# EAGLE design ltar-minidisplay (EAGLE 6.5.0)
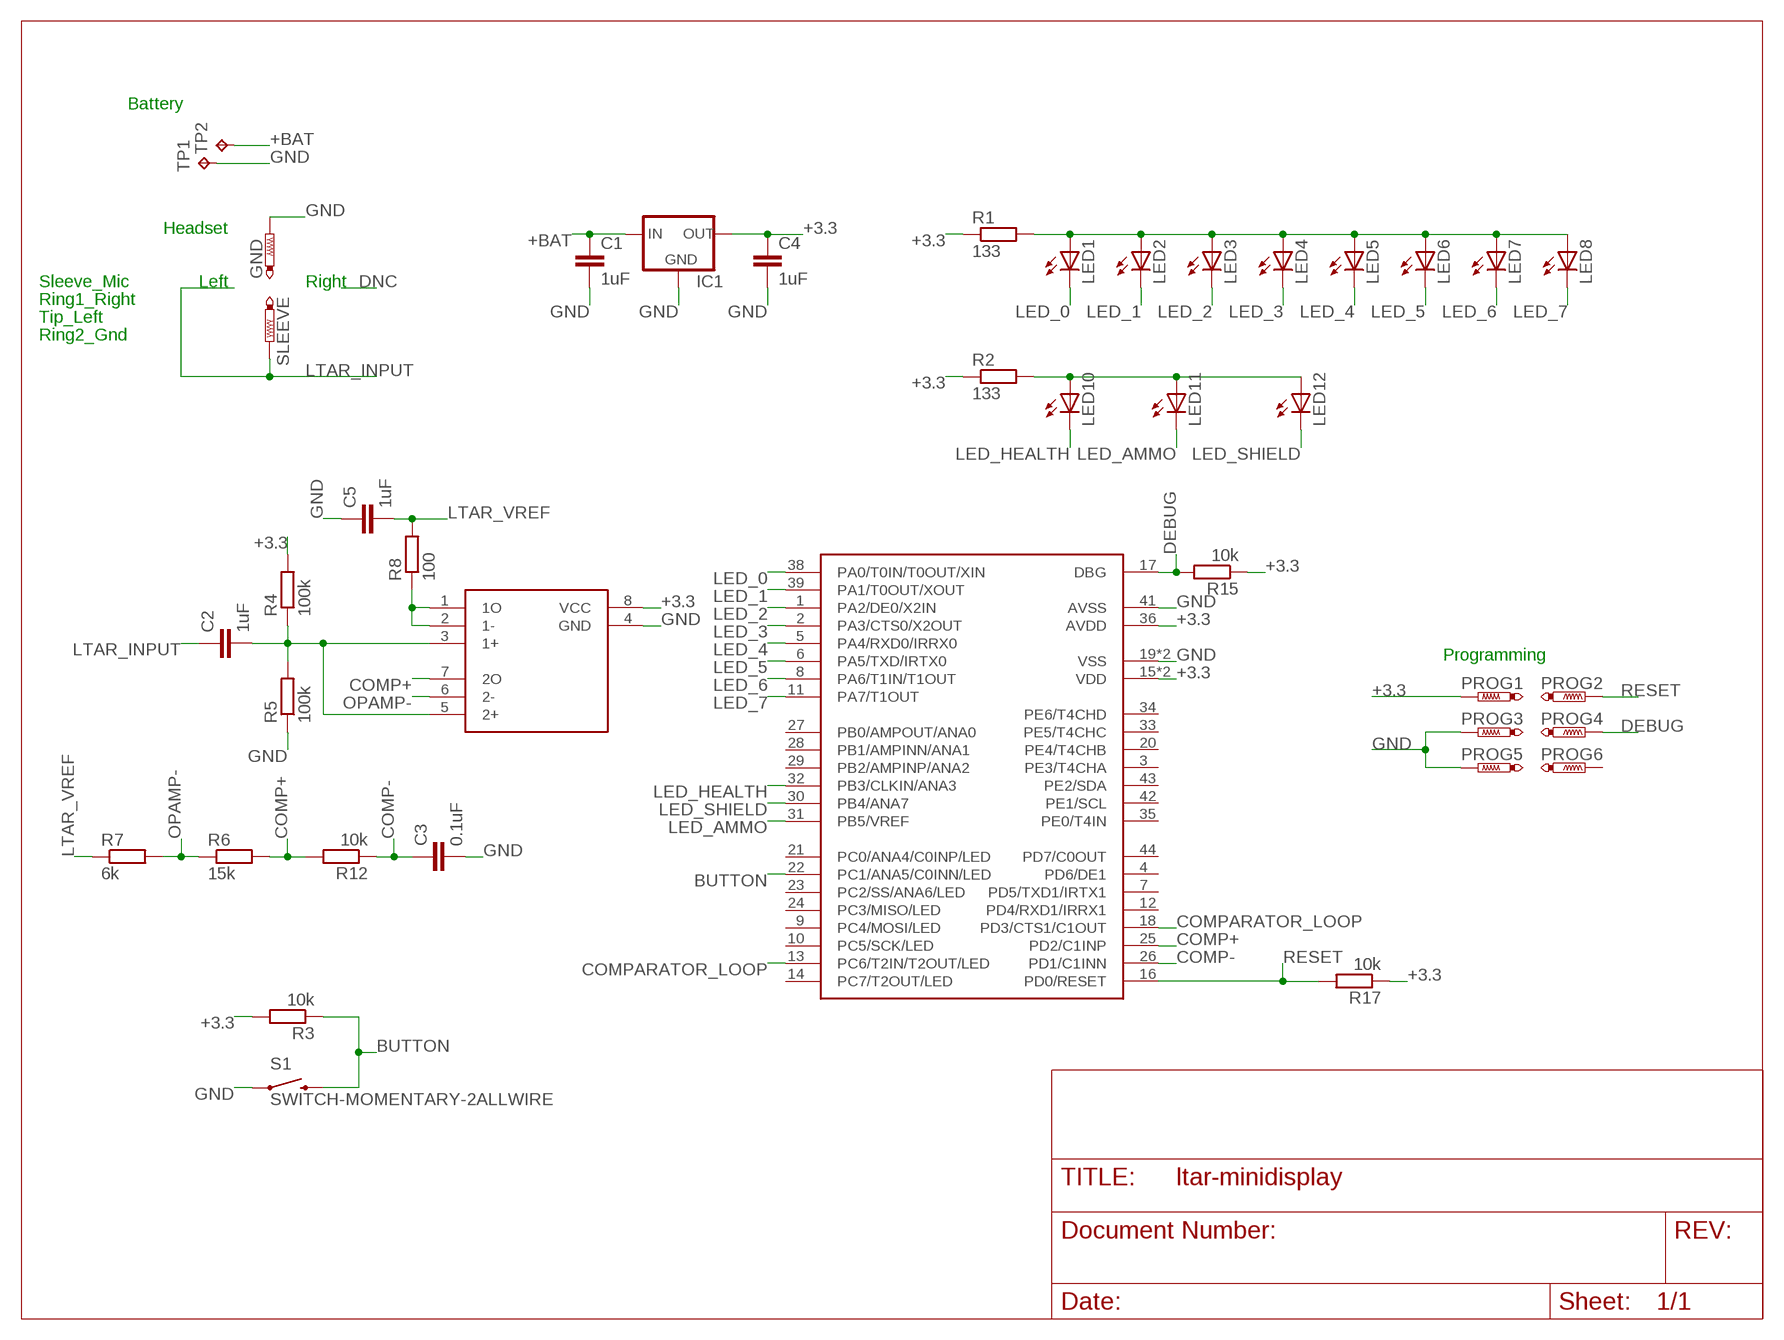
[diagram p0: schematic, sheet 1]

## Parts
C1  1uF  C-EUC0603  [C0603]
C2  1uF  C-EUC0603  [C0603]
C3  0.1uF  C-EUC0603  [C0603]
C4  1uF  C-EUC0603  [C0603]
C5  1uF  C-EUC0603  [C0603]
GND  PTR1TP11SQ  [TP11SQ]
IC1  XC63FPM  [SOT23]
LED1  LEDCHIPLED_0805  [CHIPLED_0805]
LED2  LEDCHIPLED_0805  [CHIPLED_0805]
LED3  LEDCHIPLED_0805  [CHIPLED_0805]
LED4  LEDCHIPLED_0805  [CHIPLED_0805]
LED5  LEDCHIPLED_0805  [CHIPLED_0805]
LED6  LEDCHIPLED_0805  [CHIPLED_0805]
LED7  LEDCHIPLED_0805  [CHIPLED_0805]
LED8  LEDCHIPLED_0805  [CHIPLED_0805]
LED10  LEDCHIPLED_0805  [CHIPLED_0805]
LED11  LEDCHIPLED_0805  [CHIPLED_0805]
LED12  LEDCHIPLED_0805  [CHIPLED_0805]
PROG1  PTR1TP15SQ  [TP15SQ]
PROG2  PTR1TP15SQ  [TP15SQ]
PROG3  PTR1TP15SQ  [TP15SQ]
PROG4  PTR1TP15SQ  [TP15SQ]
PROG5  PTR1TP15SQ  [TP15SQ]
PROG6  PTR1TP15SQ  [TP15SQ]
R1  133  R-EU_M0805  [M0805]
R2  133  R-EU_M0805  [M0805]
R3  10k  R-EU_M0805  [M0805]
R4  100k  R-EU_M0805  [M0805]
R5  100k  R-EU_M0805  [M0805]
R6  15k  R-EU_M0805  [M0805]
R7  6k  R-EU_M0805  [M0805]
R8  100  R-EU_M0805  [M0805]
R12  10k  R-EU_M0805  [M0805]
R15  10k  R-EU_M0805  [M0805]
R17  10k  R-EU_M0805  [M0805]
S1  SWITCH-MOMENTARY-2ALLWIRE  [TACTILE_SWITCH_SMD]
SLEEVE  PTR1TP11SQ  [TP11SQ]
TP1  TPB1,27  [B1,27]
TP2  TPB1,27  [B1,27]
U$1  Z8F2480-44  [QFP44]
U$2  TI_LM258  [SO08]

## Nets
+3.3: C4.1 IC1.2(OUT) PROG1.TP R1.1 R2.1 R3.2 R4.2 R15.1 R17.1 U$1.15(VDD) U$1.36(AVDD) U$1.37(VDD) U$2.8(VCC)
+BAT: C1.1 IC1.3(IN) TP2.TP
BUTTON: R3.1 S1.3 S1.4 U$1.22(PC1/ANA5/C0INN/LED)
COMP+: R6.2 R12.2 U$1.25(PD2/C1INP) U$2.7(2O)
COMP-: C3.1 R12.1 U$1.26(PD1/C1INN)
COMPARATOR_LOOP: U$1.13(PC6/T2IN/T2OUT/LED) U$1.18(PD3/CTS1/C1OUT)
DEBUG: PROG4.TP R15.2 U$1.17(DBG)
GND: C1.2 C3.2 C4.2 C5.1 GND.TP IC1.1(GND) PROG3.TP PROG5.TP R5.1 S1.1 S1.2 TP1.TP U$1.19(VSS) U$1.40(VSS) U$1.41(AVSS) U$2.4(GND)
LED_0: LED1.C U$1.38(PA0/T0IN/T0OUT/XIN)
LED_1: LED2.C U$1.39(PA1/T0OUT/XOUT)
LED_2: LED3.C U$1.1(PA2/DE0/X2IN)
LED_3: LED4.C U$1.2(PA3/CTS0/X2OUT)
LED_4: LED5.C U$1.5(PA4/RXD0/IRRX0)
LED_5: LED6.C U$1.6(PA5/TXD/IRTX0)
LED_6: LED7.C U$1.8(PA6/T1IN/T1OUT)
LED_7: LED8.C U$1.11(PA7/T1OUT)
LED_AMMO: LED11.C U$1.31(PB5/VREF)
LED_HEALTH: LED10.C U$1.32(PB3/CLKIN/ANA3)
LED_SHIELD: LED12.C U$1.30(PB4/ANA7)
LTAR_INPUT: C2.1 SLEEVE.TP
LTAR_VREF: C5.2 R7.1 R8.2
N$1: R8.1 U$2.1(1O) U$2.2(1-)
N$2: LED1.A LED2.A LED3.A LED4.A LED5.A LED6.A LED7.A LED8.A R1.2
N$3: LED10.A LED11.A LED12.A R2.2
OPAMP+: C2.2 R4.1 R5.2 U$2.3(1+) U$2.5(2+)
OPAMP-: R6.1 R7.2 U$2.6(2-)
RESET: PROG2.TP R17.2 U$1.16(PD0/RESET)
Unconnected: PROG6.TP U$1.3(PE3/T4CHA) U$1.4(PD6/DE1) U$1.7(PD5/TXD1/IRTX1) U$1.9(PC4/MOSI/LED) U$1.10(PC5/SCK/LED) U$1.12(PD4/RXD1/IRRX1) U$1.14(PC7/T2OUT/LED) U$1.20(PE4/T4CHB) U$1.21(PC0/ANA4/C0INP/LED) U$1.23(PC2/SS/ANA6/LED) U$1.24(PC3/MISO/LED) U$1.27(PB0/AMPOUT/ANA0) U$1.28(PB1/AMPINN/ANA1) U$1.29(PB2/AMPINP/ANA2) U$1.33(PE5/T4CHC) U$1.34(PE6/T4CHD) U$1.35(PE0/T4IN) U$1.42(PE1/SCL) U$1.43(PE2/SDA) U$1.44(PD7/C0OUT)

## Notes on the sheet
- Battery
- Headset
- Sleeve_Mic | Left | Right
- Ring1_Right
- Tip_Left
- Ring2_Gnd
- Programming

## Library data of the parts
C1-C5 = rcl:C-EU: CAPACITOR, European symbol
GND PROG1-PROG6 SLEEVE = testpad:PTR1: TEST PIN
IC1 = v-reg:XC63FP: Positiv Voltage Regulators www.torex.co.jp/english/product/pro02/pdf/0201_xc62fp.pdf
LED1-LED8 LED10-LED12 = led:LED: LED OSRAM: - CHIPLED LG R971, LG N971, LY N971, LG Q971, LY Q971, LO R971, LY R971 LH N974, LH R974 LS Q976, LO Q976, LY Q976 LO Q996 - Hyper CHIPLED LW Q18S LB Q993, LB Q99A, LB R99A - SideLED LS A670, LO A670, LY A670, LG A670, LP A670 LB A673, LV A673, LT A673, LW A673 LH A674 LY A675 LS A676, LA A676, LO A676, LY A676, LW A676 LS A679, LY A679, LG A679 - Hyper Micro SIDELED® LS Y876, LA Y876, LO Y876, LY Y876 LT Y87S - SmartLED LW L88C, LW L88S LB L89C, LB L89S, LG L890 LS L89K, LO L89K, LY L89K LS L896, LA L896, LO L896, LY L896 - TOPLED LS T670, LO T670, LY T670, LG T670, LP T670 LSG T670, LSP T670, LSY T670, LOP T670, LYG T670 LG T671, LOG T671, LSG T671 LB T673, LV T673, LT T673, LW T673 LH T674 LS T676, LA T676, LO T676, LY T676, LB T676, LH T676, LSB T676, LW T676 LB T67C, LV T67C, LT T67C, LS T67K, LO T67K, LY T67K, LW E67C LS E67B, LA E67B, LO E67B, LY E67B, LB E67C, LV E67C, LT E67C LW T67C LS T679, LY T679, LG T679 LS T770, LO T770, LY T770, LG T770, LP T770 LB T773, LV T773, LT T773, LW T773 LH T774 LS E675, LA E675, LY E675, LS T675 LS T776, LA T776, LO T776, LY T776, LB T776 LHGB T686 LT T68C, LB T68C - Hyper Mini TOPLED® LB M676 - Mini TOPLED Santana® LG M470 LS M47K, LO M47K, LY M47K Source: http://www.osram.convergy.de LUXEON: - LUMILED® LXK2-PW12-R00, LXK2-PW12-S00, LXK2-PW14-U00, LXK2-PW14-V00 LXK2-PM12-R00, LXK2-PM12-S00, LXK2-PM14-U00 LXK2-PE12-Q00, LXK2-PE12-R00, LXK2-PE12-S00, LXK2-PE14-T00, LXK2-PE14-U00 LXK2-PB12-K00, LXK2-PB12-L00, LXK2-PB12-M00, LXK2-PB14-N00, LXK2-PB14-P00, LXK2-PB14-Q00 LXK2-PR12-L00, LXK2-PR12-M00, LXK2-PR14-Q00, LXK2-PR14-R00 LXK2-PD12-Q00, LXK2-PD12-R00, LXK2-PD12-S00 LXK2-PH12-R00, LXK2-PH12-S00 LXK2-PL12-P00, LXK2-PL12-Q00, LXK2-PL12-R00 Source: www.luxeon.com KINGBRIGHT: KA-3528ASYC Source: www.kingbright.com
R1 R2 = resistor:R-EU_: RESISTOR, European symbol
R3-R8 R12 R15 R17 = rcl:R-EU_: RESISTOR, European symbol
S1 = SparkFun:SWITCH-MOMENTARY-2
TP1 TP2 = testpad:TP: Test pad
U$1 = izzy:Z8F2480-44
U$2 = izzy:TI_LM258: TI dual OP-AMP LM258/LM258A

## Board
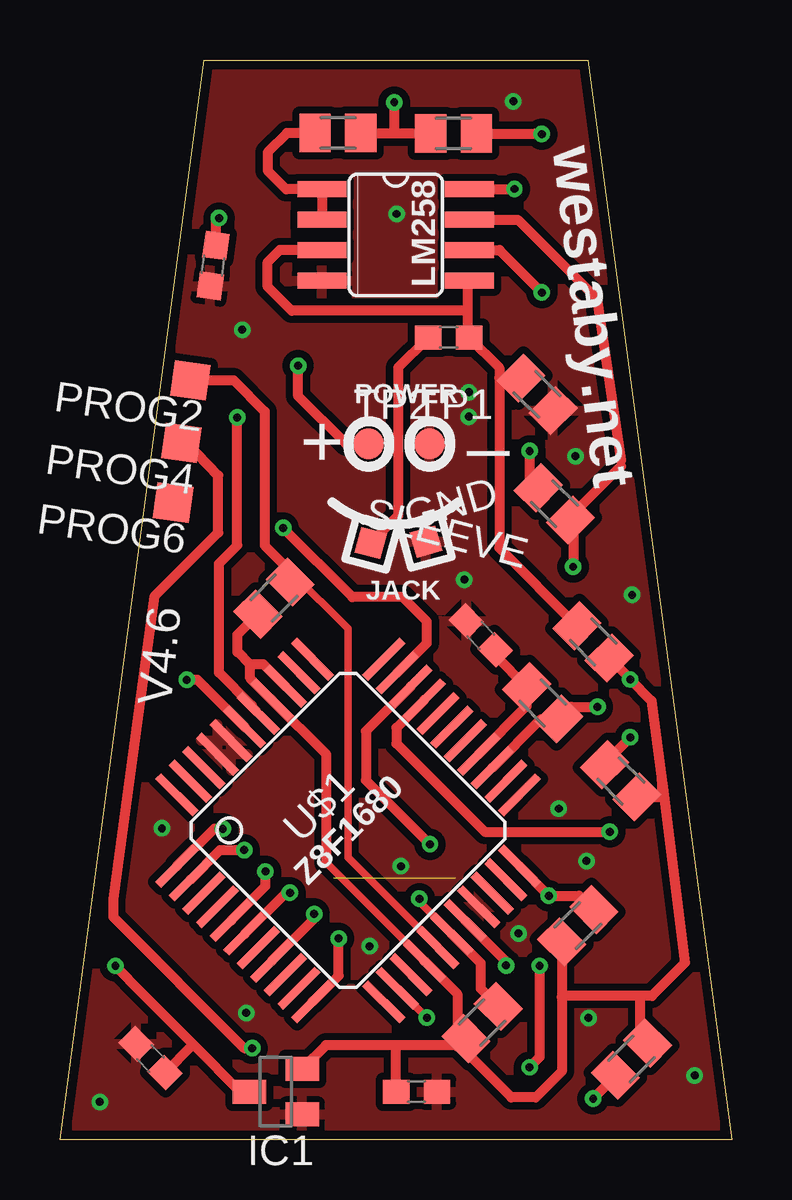
[diagram p1: board, top side]
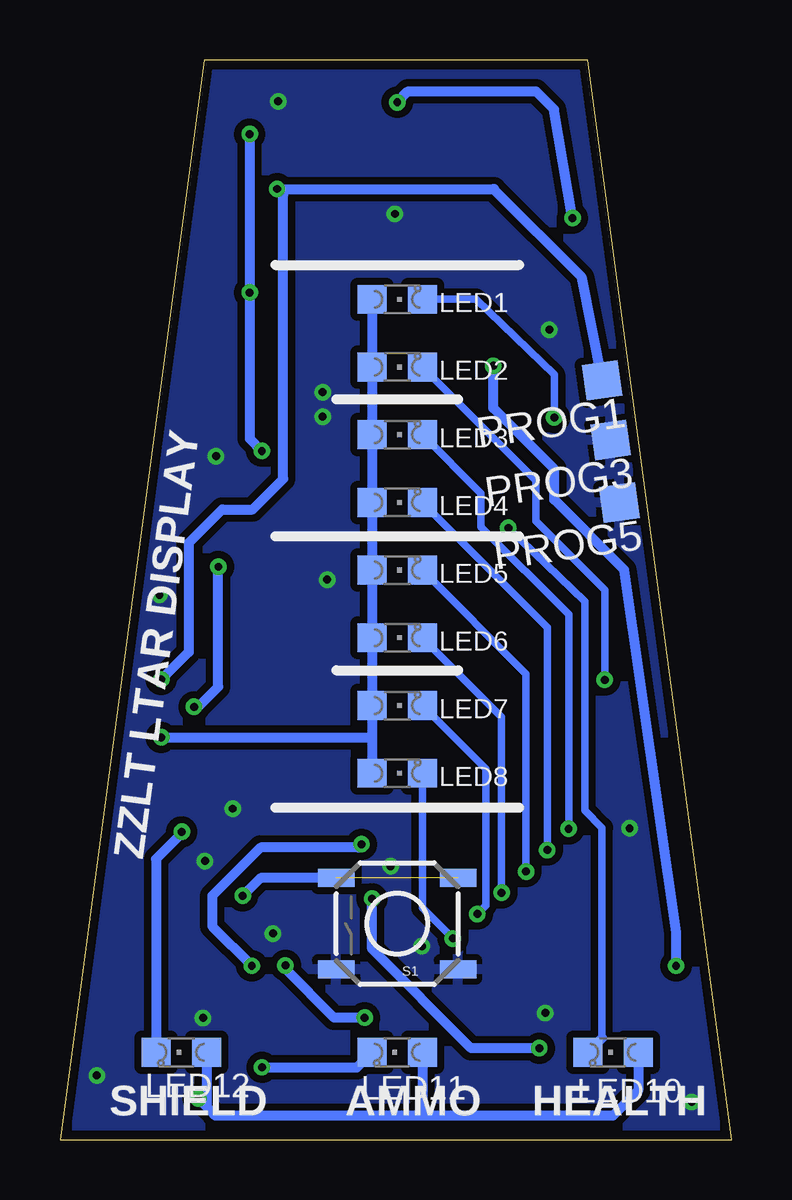
[diagram p2: board, bottom side, seen from below]

Size 28 x 45 mm. Coordinates in mm from the lower left corner, seen from the top.
Outline: 28,0 0,0 6,45 22,45 28,0
Copper layers (1*16): Top 0.0356mm / dielectric 1.5011mm / Bottom 0.0356mm
Design rules "default": minimum track width 6mil, minimum drill 13mil, track to track 6mil, track to pad 6mil, pad to pad 6mil, via to via 6mil, smd to smd 6mil, copper to edge 15mil, drill to drill 6mil, minimum pad ring 7mil, minimum via ring 7mil, stop-mask expansion 4mil, vias tented up to drill 13mil, thermal gap 10mil

### Footprints (pad centres in the part's own frame; a part is rotated, then mirrored left to right if it is on the bottom)
C0603 = smd 1.1 x 1: 1 -0.85,0; 2 0.85,0
TP11SQ = smd 1.1 x 1.1: TP 0,0
SOT23 = smd 1 x 1.4: 1 -0.95,-1.1; 2 0.95,-1.1; 3 0,1.1
CHIPLED_0805 = smd 1.2 x 1.2: A 0,-1.05; C 0,1.05
TP15SQ = smd 1.5 x 1.5: TP 0,0
M0805 = smd 1.3 x 1.6: 1 -0.95,0; 2 0.95,0
TACTILE_SWITCH_SMD = smd 1.524 x 0.762: 1 -2.54,1.905; 2 2.54,1.905; 3 -2.54,-1.905; 4 2.54,-1.905
B1,27 = smd 1.27 x 1.27: TP 0,0
QFP44 = smd 2.2 x 0.35: 1 -6.1,4; 2 -6.1,3.2; 3 -6.1,2.4; 4 -6.1,1.6; 5 -6.1,0.8; 6 -6.1,0; 7 -6.1,-0.8; 8 -6.1,-1.6; 9 -6.1,-2.4; 10 -6.1,-3.2; 11 -6.1,-4; 23 6.1,-4; 24 6.1,-3.2; 25 6.1,-2.4; 26 6.1,-1.6; 27 6.1,-0.8; 28 6.1,0; 29 6.1,0.8; 30 6.1,1.6; 31 6.1,2.4; 32 6.1,3.2; 33 6.1,4 | smd 0.35 x 2.2: 12 -4,-6.1; 13 -3.2,-6.1; 14 -2.4,-6.1; 15 -1.6,-6.1; 16 -0.8,-6.1; 17 0,-6.1; 18 0.8,-6.1; 19 1.6,-6.1; 20 2.4,-6.1; 21 3.2,-6.1; 22 4,-6.1; 34 4,6.1; 35 3.2,6.1; 36 2.4,6.1; 37 1.6,6.1; 38 0.8,6.1; 39 0,6.1; 40 -0.8,6.1; 41 -1.6,6.1; 42 -2.4,6.1; 43 -3.2,6.1; 44 -4,6.1
SO08 = smd 0.66 x 2.032: 1 -1.905,-3.073; 2 -0.635,-3.073; 3 0.635,-3.073; 4 1.905,-3.073; 5 1.905,3.073; 6 0.635,3.073; 7 -0.635,3.073; 8 -1.905,3.073

### Placement (x,y rotation side)
C1  3.78,3.39 135 top
C2  16.21,33.43 0 top
C3  17.55,21.01 135 top
C4  14.87,2 0 top
C5  6.39,36.42 82 top
GND  15.26,24.92 16 top
IC1  9,2 90 top
LED1  13.94,35.02 270 bottom
LED2  13.94,32.2 270 bottom
LED3  13.94,29.38 270 bottom
LED4  13.94,26.56 270 bottom
LED5  13.94,23.73 270 bottom
LED6  13.94,20.91 270 bottom
LED7  13.94,18.09 270 bottom
LED8  13.94,15.27 270 bottom
LED10  4.94,3.64 90 bottom
LED11  13.94,3.64 90 bottom
LED12  22.94,3.64 90 bottom
PROG1  5.39,31.64 188 bottom
PROG2  5.43,31.65 172 top
PROG3  5.04,29.16 188 bottom
PROG4  5.07,29.04 172 top
PROG5  4.68,26.55 188 bottom
PROG6  4.72,26.55 172 top
R1  23.38,14.95 135 top
R2  23.83,3.35 225 top
R3  21.59,8.92 225 top
R4  22.23,20.74 315 top
R5  19.89,31.06 135 top
R6  20.61,26.5 315 top
R7  16.41,41.93 0 top
R8  11.59,41.95 0 top
R12  20.13,18.2 315 top
R15  17.6,4.88 45 top
R17  8.92,22.57 45 top
S1  13.94,9 180 bottom
SLEEVE  12.96,24.86 345 top
TP1  15.41,29 0 top
TP2  12.87,29 0 top
U$1  12.01,12.88 45 top
U$2  14,37.71 270 top

### Tracks (layer width: path | path; a pad name or v marks a point on that pad's centre or on a via)
+3.3  (via drill 0.33)
  Top 0.305: U$1.15 11.11,11.53 | 16.57,4.57 R15.1 16.67,3.94 16.56,3.83
  Top 0.406: 7.93,19.81 7.93,19.23 U$1.37 11.11,16.05 11.11,11.53 | U$1.36 8.48,19.81 7.93,19.81 | 24.44,4.7 24.44,4.06 24.46,4.06 R2.1 24.19,4.34 24.19,5.89 24.28,5.98 | 16.67,3.94 14,3.94 | 14,3.94 11.09,3.94 IC1.2 | U$1.15 16.57,6.06 16.57,4.57 | 18.94,39.61 v18.95,39.62 U$2.8 | 25.1,14.84 25.09,14.98 24.66,18.29 v23.77,19.18 23.77,19.2 R4.2 | 25.1,14.84 26.06,7.37 24.68,5.98 24.28,5.98 | R17.1 7.39,21.04 7.39,20.32 7.43,20.32 7.93,19.81 | C4.1 14.02,3.91 14,3.94 | R3.2 20.92,5.94 | 20.92,5.94 20.92,2.84 19.84,1.75 18.82,1.75 17.04,3.53 17.04,4.09 R15.1 | 24.28,5.98 20.96,5.98 20.92,5.94 | R1.1 25.1,14.28 25.1,14.84
  Bottom 0.406: 9.93,39.62 9.91,39.62 | 9.93,39.62 6.25,35.94 PROG1.TP | 9.93,39.62 v18.95,39.62 18.69,39.37 18.69,27.53 19.96,26.26 21.23,26.26 22.63,24.87 22.63,20.32 v23.77,19.18
+BAT  (via drill 0.33)
  Top 0.406: v2.31,7.24 3.42,6.1 5.57,3.95 | 5.57,3.95 7.52,2 IC1.3 | C1.1 5.54,3.95 5.57,3.95 | TP2.TP 11.92,29 9.93,30.99 v9.93,32.26
  Bottom 0.406: v2.31,7.24 2.31,8.64 4.47,23.75 7.39,26.67 7.39,27.94 9.93,30.48 v9.93,32.26
BUTTON  (via drill 0.33)  (1 unrouted)
  Top 0.152: v20.38,10.16 v20.39,10.16
  Top 0.406: U$1.22 v20.39,10.16 21.65,10.16 22.22,9.59 R3.1
  Bottom 0.406: S1.4 19.64,10.9 v20.38,10.16
COMP+  (via drill 0.33)
  Top 0.305: R6.2 21.28,26.34 21.67,26.34 | 23.39,28.07 23.39,28.32
  Top 0.406: U$2.7 19.09,38.34 22.38,35.05 23.39,28.32 | 21.67,26.34 23.39,28.07 | R6.2 21.4,25.71 v21.4,23.88 | U$1.25 20.06,17.53 R12.2 21.31,18.03 v22.41,18.03
  Bottom 0.406: v21.4,23.88 21.4,18.87 22.23,18.03 v22.41,18.03
COMP-
  Top 0.406: U$1.26 19.46,18.06 R12.1 18.15,20.18 C3.1
COMPARATOR_LOOP  (via drill 0.33)
  Top 0.305: U$1.13 v15.3,5.08 | 18.6,7.43 v18.6,7.25
  Top 0.406: U$1.18 18.6,7.43
  Bottom 0.305: 18.6,7.11 v18.6,7.25
  Bottom 0.406: v15.3,5.08 16.57,5.08 18.6,7.11
DEBUG  (via drill 0.33)
  Top 0.305: v14.99,10.04 14.99,9.91 U$1.17 | 18.27,5.57 R15.2
  Top 0.406: PROG4.TP 5.28,29.04 6.6,27.69 6.6,25.3 3.93,22.63 2.22,10.03 2.22,9.27 7.68,3.81 v8.02,3.81 | U$1.17 17.54,7.36 17.54,6.3 18.27,5.57
  Bottom 0.406: v8.02,3.81 10.86,3.81 14.99,7.94 v14.99,10.04
GND  (via drill 0.33)
  Bottom 0.254: v14.22,11.39 14.13,11.57
  other vias: 21.95,11.61 16.86,23.34 1.66,1.57 4.25,12.97 7.77,5.28 22.04,5.07 12.91,8.05 20.79,13.79 26.46,2.67 19.12,8.59 14.04,38.58 7.6,33.75 18.9,43.28 17.05,30.13 23.85,22.71 21.49,28.48 17.05,31.15
  pour Top (isolate 0.305): 28,0 22,45 6,45 0,0
  pour Bottom (isolate 0.305): 28,0 22,45 6,45 0,0
LED_0  (via drill 0.33)
  Top 0.305: 8.19,17.91 8,18.1 8,18.03 U$1.38
  Top 0.406: 8,18.1 6.63,19.47 6.63,24 7.39,24.76 v7.39,30.1
  Bottom 0.305: LED1.C 10.67,35.02 7.39,31.88 v7.39,30.1
LED_1  (via drill 0.33)
  Top 0.406: U$1.39 5.74,19.16 v5.28,19.16
  Bottom 0.305: 5.28,19.23 v5.28,19.16 5.28,22.91 8.15,25.78 8.15,27.46 LED2.C
LED_2  (via drill 0.33)
  Top 0.406: U$1.1 6.43,12.95 v6.79,12.95
  Bottom 0.305: v6.79,12.95 6.79,21.88 10.44,25.53 10.44,26.93 LED3.C
LED_3  (via drill 0.33)
  Top 0.305: U$1.2
  Top 0.406: U$1.2 6.67,12.06 v7.68,12.06
  Bottom 0.305: v7.68,12.06 7.68,21.35 LED4.C
LED_4  (via drill 0.33)
  Top 0.406: U$1.5 8.57,10.57 v8.57,11.18
  Bottom 0.305: v8.57,11.18 8.57,19.41 LED5.C
LED_5  (via drill 0.33)
  Top 0.305: 9.42,10.29 v9.59,10.29
  Top 0.406: U$1.6 9.42,10.29
  Bottom 0.305: v9.59,10.29 9.59,17.61 LED6.C
LED_6  (via drill 0.33)
  Top 0.305: 10.6,9.21 v10.6,9.4
  Top 0.406: U$1.8 10.6,9.21
  Bottom 0.305: 10.54,9.4 v10.6,9.4 10.24,9.76 10.24,15.44 LED7.C
LED_7  (via drill 0.33)
  Top 0.406: U$1.11 11.62,6.83 v11.62,8.38
  Bottom 0.305: v11.62,8.38 12.89,9.65 LED8.C
LED_AMMO  (via drill 0.33)
  Top 0.406: U$1.31 12.76,17.02 12.76,14.97 v15.43,12.3 | v20,7.24 20,3.43 v19.58,3.01
  Bottom 0.305: 15.55,12.18 v15.43,12.3
  Bottom 0.406: v20,7.24 21.65,8.89 21.65,10.16 19.63,12.18 15.55,12.18 | v19.58,3.01 15.62,3.01 LED11.C
LED_HEALTH  (via drill 0.33)
  Top 0.406: U$1.32 15.3,20.69 15.3,21.59 14.28,22.61 12.19,22.61 v9.3,25.49
  Bottom 0.305: 5.4,4.22 5.4,13 6.12,13.72 6.12,22.44 v9.3,25.49
  Bottom 0.406: 5.4,4.22 LED10.C
LED_SHIELD  (via drill 0.33)
  Top 0.406: U$1.30 14.03,17.16 14.03,16.51 17.71,12.83 v22.92,12.83
  Bottom 0.406: v22.92,12.83 22.86,12.83 23.99,11.7 LED12.C
LTAR_INPUT
  Top 0.406: C2.1 14.1,32.17 14.1,26 SLEEVE.TP
LTAR_VREF  (via drill 0.33)
  Top 0.305: 12.56,41.93 R8.2 | 13.94,41.99 14,41.93
  Top 0.406: R7.1 14,41.93 12.56,41.93 | v13.94,43.24 13.94,41.99 | C5.2 6.51,38.28 v6.63,38.41
  Bottom 0.406: v6.63,38.41 7.4,42.94 8.15,43.69 13.49,43.69 v13.94,43.24
N$1
  Top 0.406: U$2.2 U$2.1 9.43,39.61 8.66,40.39 8.66,41.15 9.47,41.95 R8.1
N$2  (via drill 0.33)
  Top 0.406: R1.2 22.71,15.7 v23.77,16.76
  Bottom 0.406: LED1.A LED2.A LED3.A LED4.A LED5.A LED6.A LED7.A 14.99,16.87 | 14.99,16.87 LED8.A | v23.77,16.76 15.09,16.76 14.99,16.87
N$3  (via drill 0.33)
  Top 0.406: R2.2 23.16,2.63 v22.23,1.7
  Bottom 0.305: 12.89,1.05 12.94,1
  Bottom 0.406: LED10.A 3.89,2.05 4.94,1 12.94,1 21.52,1 21.69,1.17 21.89,1.37 | LED11.A 12.89,1.05 | 21.89,1.37 v22.23,1.7 | LED12.A 21.89,1.37
N$4
  pour Top (isolate 0.305): 7.01,22.07 7.01,23.85 8.03,24.87 9.04,23.85 7.01,21.95
N$5
  pour Top (isolate 0.305): 17.42,3.4 19.33,5.44 19.71,5.05 19.71,3.4 18.57,2.26
OPAMP+
  Top 0.305: 17,35.73 U$2.5 | 16.87,34.54 17,34.67
  Top 0.406: 17,35.73 17,34.67 17,33.49 C2.2 18.31,32.18 18.31,31.75 | U$2.3 9.16,37.07 8.66,36.58 8.66,35.55 9.66,34.54 16.87,34.54 | R4.1 18.31,24.66 18.31,31.75 | R5.2 18.33,31.73 18.31,31.75 | 18.31,31.75 18.57,31.75 18.82,31.5
OPAMP-  (via drill 0.33)
  Top 0.406: R7.2 19.82,41.93 v20.09,41.91 | U$2.6 18.32,37.07 v20.09,35.31 | R6.1 19.58,27.53 v19.58,28.7
  Bottom 0.406: v20.09,41.91 v20.09,35.31 20.09,29.21 v19.58,28.7
RESET
  Top 0.305: U$1.16 12,11.77 12,21.3 9.68,23.62
  Top 0.406: 5.96,31.63 PROG2.TP 7.24,31.65 8.53,30.35 8.53,24.76 9.68,23.62 9.68,23.32 R17.2

### Text on the board
tPlace: LM258 | _ | POWER | + | westaby.net | V4.6 | JACK | Z8F1680
bPlace: ZZLT LTAR DISPLAY | HEALTH | AMMO | SHIELD
tStop: 100 | 5.9k | 1uF | 1uF | 100k | 5V | GND | S | GND | 15k | 10k | L | 0.1uF | 100k | 10k | 133 | 10k | 10k | 1uF | 3.3V | 133 | 1uF
bStop: 1